# EAGLE design Middle Board - Light (EAGLE 8.6.0)
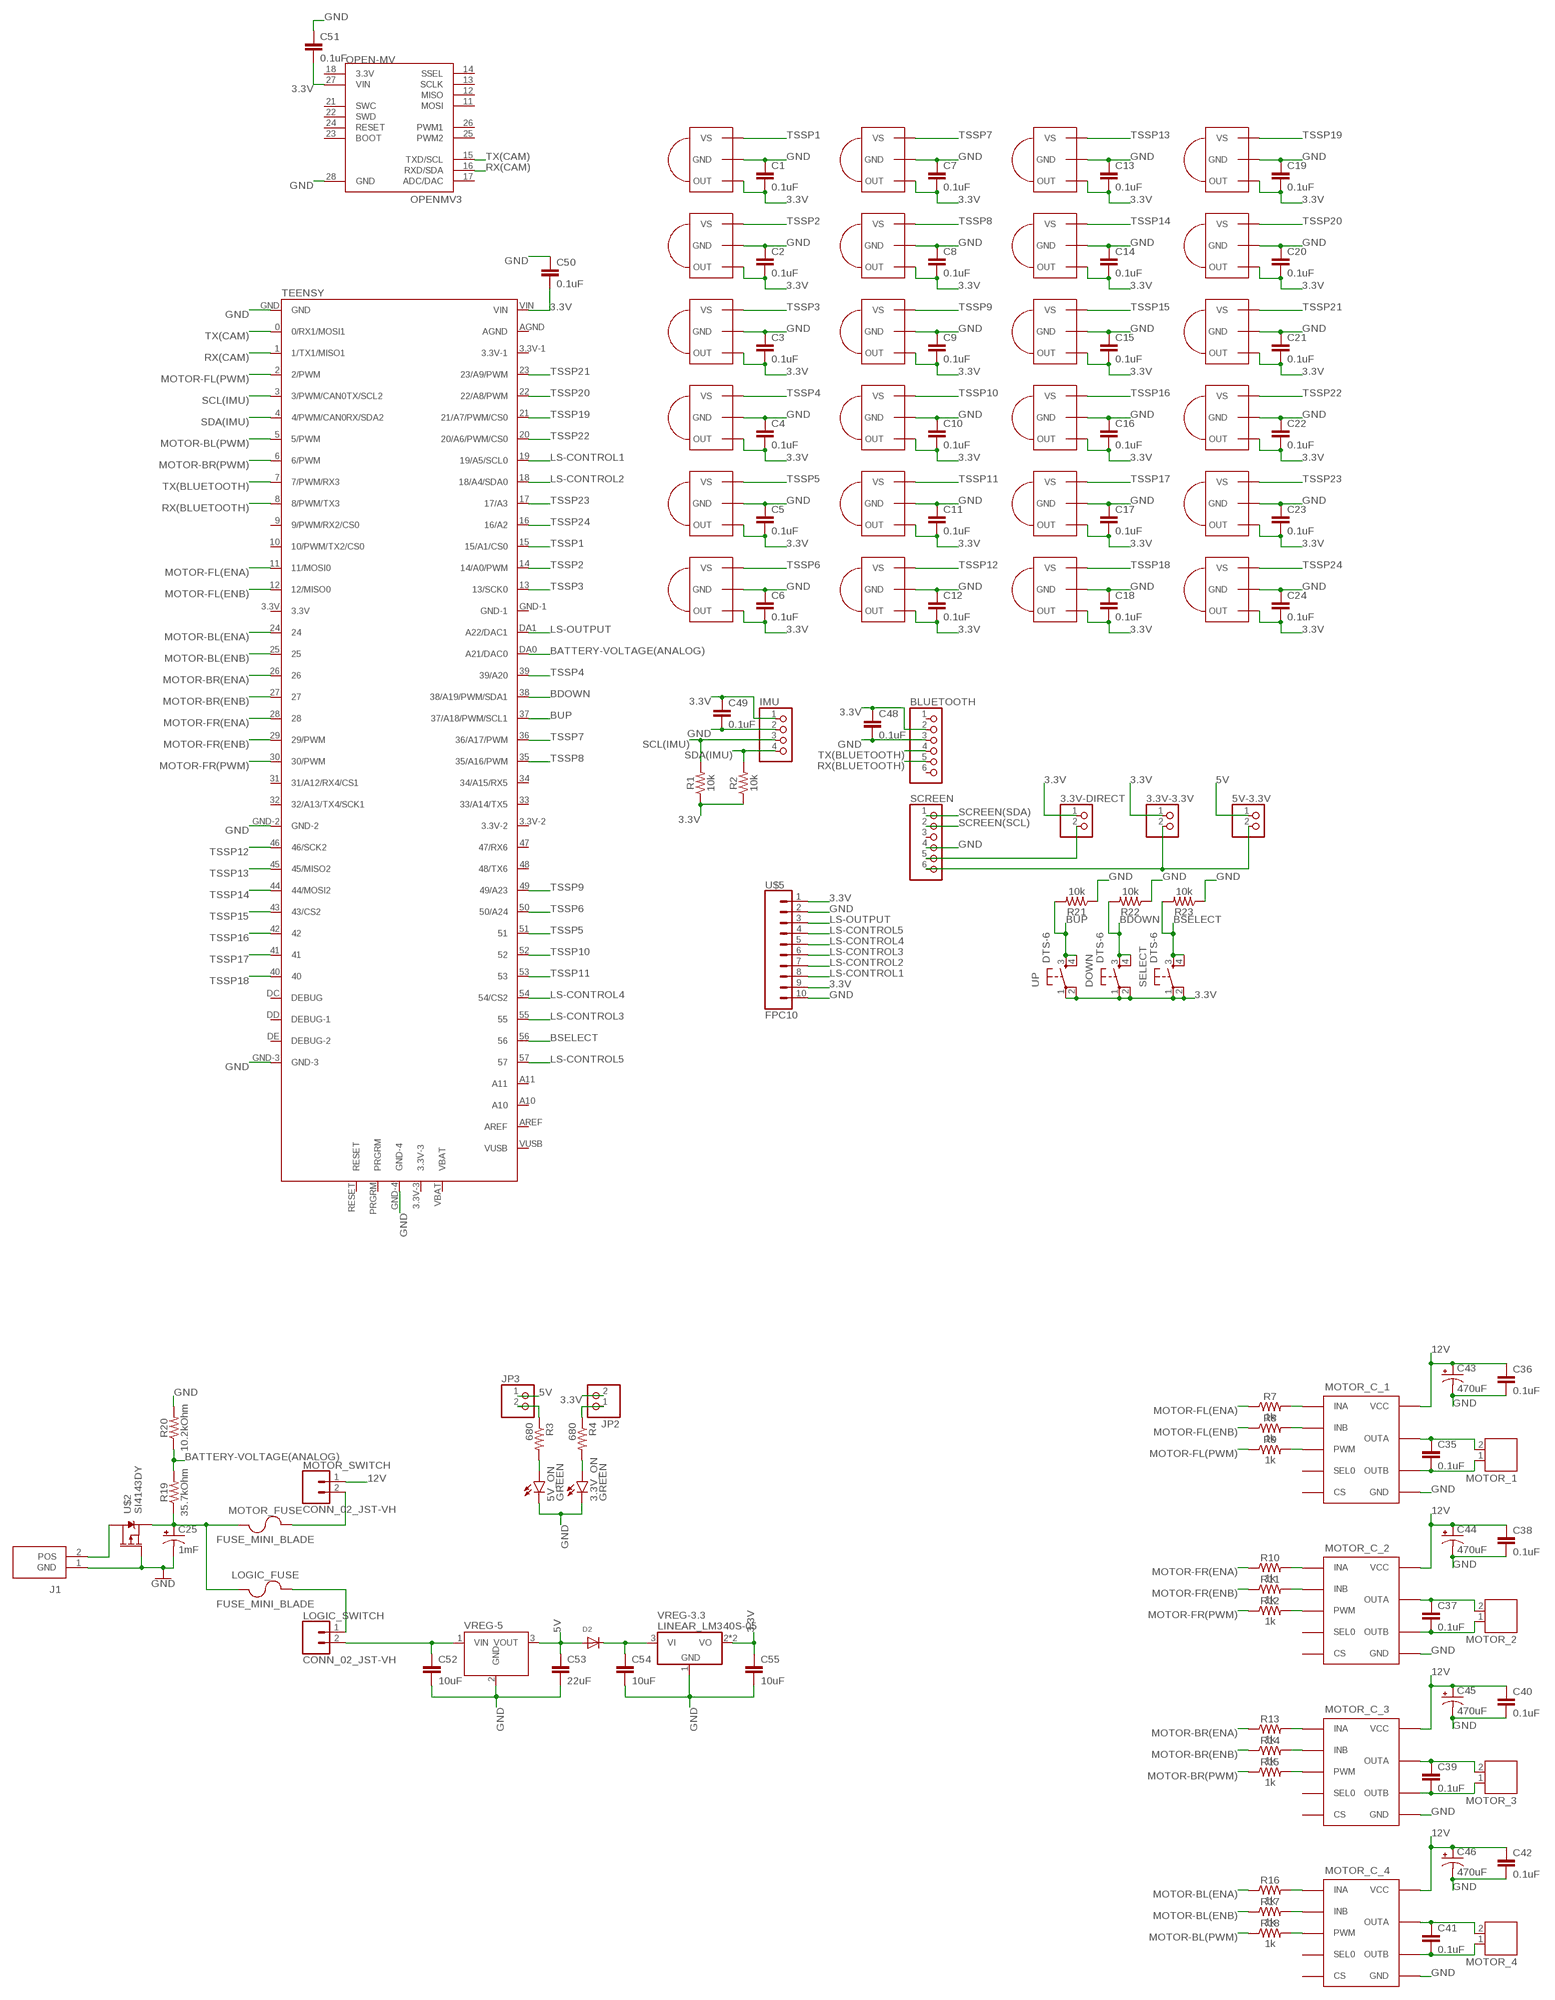
[diagram p0: schematic, sheet 1]

## Parts
3.3V-3.3V  PINHD-1X2  [1X02]
3.3V-DIRECT  PINHD-1X2  [1X02]
3.3V_ON  GREEN  LED_SMD  [LED-0603]
5V-3.3V  PINHD-1X2  [1X02]
5V_ON  GREEN  LED_SMD  [LED-0603]
BLUETOOTH  PINHD-1X6  [1X06]
C1  0.1uF  0.1UF-0603-25V-(+80/-20%)  [0603]
C2  0.1uF  0.1UF-0603-25V-(+80/-20%)  [0603]
C3  0.1uF  0.1UF-0603-25V-(+80/-20%)  [0603]
C4  0.1uF  0.1UF-0603-25V-(+80/-20%)  [0603]
C5  0.1uF  0.1UF-0603-25V-(+80/-20%)  [0603]
C6  0.1uF  0.1UF-0603-25V-(+80/-20%)  [0603]
C7  0.1uF  0.1UF-0603-25V-(+80/-20%)  [0603]
C8  0.1uF  0.1UF-0603-25V-(+80/-20%)  [0603]
C9  0.1uF  0.1UF-0603-25V-(+80/-20%)  [0603]
C10  0.1uF  0.1UF-0603-25V-(+80/-20%)  [0603]
C11  0.1uF  0.1UF-0603-25V-(+80/-20%)  [0603]
C12  0.1uF  0.1UF-0603-25V-(+80/-20%)  [0603]
C13  0.1uF  0.1UF-0603-25V-(+80/-20%)  [0603]
C14  0.1uF  0.1UF-0603-25V-(+80/-20%)  [0603]
C15  0.1uF  0.1UF-0603-25V-(+80/-20%)  [0603]
C16  0.1uF  0.1UF-0603-25V-(+80/-20%)  [0603]
C17  0.1uF  0.1UF-0603-25V-(+80/-20%)  [0603]
C18  0.1uF  0.1UF-0603-25V-(+80/-20%)  [0603]
C19  0.1uF  0.1UF-0603-25V-(+80/-20%)  [0603]
C20  0.1uF  0.1UF-0603-25V-(+80/-20%)  [0603]
C21  0.1uF  0.1UF-0603-25V-(+80/-20%)  [0603]
C22  0.1uF  0.1UF-0603-25V-(+80/-20%)  [0603]
C23  0.1uF  0.1UF-0603-25V-(+80/-20%)  [0603]
C24  0.1uF  0.1UF-0603-25V-(+80/-20%)  [0603]
C25  1mF  1000UF-RADIAL-5MM-25V-20%  [CPOL-RADIAL-5MM-10MM]
C35  0.1uF  0.1UF-0603-25V-(+80/-20%)  [0603]
C36  0.1uF  0.1UF-0603-25V-(+80/-20%)  [0603]
C37  0.1uF  0.1UF-0603-25V-(+80/-20%)  [0603]
C38  0.1uF  0.1UF-0603-25V-(+80/-20%)  [0603]
C39  0.1uF  0.1UF-0603-25V-(+80/-20%)  [0603]
C40  0.1uF  0.1UF-0603-25V-(+80/-20%)  [0603]
C41  0.1uF  0.1UF-0603-25V-(+80/-20%)  [0603]
C42  0.1uF  0.1UF-0603-25V-(+80/-20%)  [0603]
C43  470uF  CPOL-USE3.5-8  [E3,5-8]
C44  470uF  CPOL-USE3.5-8  [E3,5-8]
C45  470uF  CPOL-USE3.5-8  [E3,5-8]
C46  470uF  CPOL-USE3.5-8  [E3,5-8]
C48  0.1uF  0.1UF-0603-25V-(+80/-20%)  [0603]
C49  0.1uF  0.1UF-0603-25V-(+80/-20%)  [0603]
C50  0.1uF  0.1UF-0603-25V-(+80/-20%)  [0603]
C51  0.1uF  0.1UF-0603-25V-(+80/-20%)  [0603]
C52  10uF  0805_CAPACITOR_SMD  [SPARKFUN-CAPACITORS_0805]
C53  22uF  1206_CAPACITOR_SMD  [SPARKFUN-CAPACITORS_1206]
C54  10uF  0805_CAPACITOR_SMD  [SPARKFUN-CAPACITORS_0805]
C55  10uF  0805_CAPACITOR_SMD  [SPARKFUN-CAPACITORS_0805]
D2  ADAFRUIT_DIODE_SOD-123FL:1  [ADAFRUIT_SOD-123FL]
DOWN  DTS-6  [DTS-6]
IMU  PINHD-1X4  [1X04]
J1  PRT-10474  [SHDR2W320P716_1X2_1574X813X158]
JP2  PINHD-1X2/90  [1X02/90]
JP3  PINHD-1X2/90  [1X02/90]
LOGIC_FUSE  FUSE_MINI_BLADE  [SL-1538]
LOGIC_SWITCH  CONN_02_JST-VH  [B2P-VH]
MOTOR_1  JST-PH2  [JST-PH2]
MOTOR_2  JST-PH2  [JST-PH2]
MOTOR_3  JST-PH2  [JST-PH2]
MOTOR_4  JST-PH2  [JST-PH2]
MOTOR_C_1  VNH7100BASTR  [SO-16]
MOTOR_C_2  VNH7100BASTR  [SO-16]
MOTOR_C_3  VNH7100BASTR  [SO-16]
MOTOR_C_4  VNH7100BASTR  [SO-16]
MOTOR_FUSE  FUSE_MINI_BLADE  [SL-1538]
MOTOR_SWITCH  CONN_02_JST-VH  [B2P-VH]
OPEN-MV  OPENMV3  [OPENMV3]
R1  10k  10KOHM-0603-1/10W-1%  [0603]
R2  10k  10KOHM-0603-1/10W-1%  [0603]
R3  680  RESISTOR0603  [0603]
R4  680  RESISTOR0603  [0603]
R7  1k  1KOHM-0603-1/10W-1%  [0603]
R8  1k  1KOHM-0603-1/10W-1%  [0603]
R9  1k  1KOHM-0603-1/10W-1%  [0603]
R10  1k  1KOHM-0603-1/10W-1%  [0603]
R11  1k  1KOHM-0603-1/10W-1%  [0603]
R12  1k  1KOHM-0603-1/10W-1%  [0603]
R13  1k  1KOHM-0603-1/10W-1%  [0603]
R14  1k  1KOHM-0603-1/10W-1%  [0603]
R15  1k  1KOHM-0603-1/10W-1%  [0603]
R16  1k  1KOHM-0603-1/10W-1%  [0603]
R17  1k  1KOHM-0603-1/10W-1%  [0603]
R18  1k  1KOHM-0603-1/10W-1%  [0603]
R19  35.7kOhm  75KOHM-0603-1/10W-1%  [0603]
R20  10.2kOhm  75KOHM-0603-1/10W-1%  [0603]
R21  10k  10KOHM-0603-1/10W-1%  [0603]
R22  10k  10KOHM-0603-1/10W-1%  [0603]
R23  10k  10KOHM-0603-1/10W-1%  [0603]
SCREEN  PINHD-1X6  [1X06]
SELECT  DTS-6  [DTS-6]
TEENSY  TEENSY-3.5  [TEENSY-3.5]
TSSP1  TSSP58038  [MINICAST]
TSSP2  TSSP58038  [MINICAST]
TSSP3  TSSP58038  [MINICAST]
TSSP4  TSSP58038  [MINICAST]
TSSP5  TSSP58038  [MINICAST]
TSSP6  TSSP58038  [MINICAST]
TSSP7  TSSP58038  [MINICAST]
TSSP8  TSSP58038  [MINICAST]
TSSP9  TSSP58038  [MINICAST]
TSSP10  TSSP58038  [MINICAST]
TSSP11  TSSP58038  [MINICAST]
TSSP12  TSSP58038  [MINICAST]
TSSP13  TSSP58038  [MINICAST]
TSSP14  TSSP58038  [MINICAST]
TSSP15  TSSP58038  [MINICAST]
TSSP16  TSSP58038  [MINICAST]
TSSP17  TSSP58038  [MINICAST]
TSSP18  TSSP58038  [MINICAST]
TSSP19  TSSP58038  [MINICAST]
TSSP20  TSSP58038  [MINICAST]
TSSP21  TSSP58038  [MINICAST]
TSSP22  TSSP58038  [MINICAST]
TSSP23  TSSP58038  [MINICAST]
TSSP24  TSSP58038  [MINICAST]
U$2  SI4143DY  [SO-8]
U$5  FPC10  [FPC10]
UP  DTS-6  [DTS-6]
VREG-3.3  LINEAR_LM340S-05  [LINEAR_TO263-3]
VREG-5  V78-2000-SWITCHING-REGULATOR_V78-2000  [V78-2000-SWITCHING-REGULATOR_V78-2000]

## Nets
3.3V: 3.3V-3.3V.1 3.3V-DIRECT.1 BLUETOOTH.2 C1.2 C2.2 C3.2 C4.2 C5.2 C6.2 C7.2 C8.2 C9.2 C10.2 C11.2 C12.2 C13.2 C14.2 C15.2 C16.2 C17.2 C18.2 C19.2 C20.2 C21.2 C22.2 C23.2 C24.2 C48.1 C49.1 C50.2 C51.2 C55.1 DOWN.1 DOWN.2 IMU.1 JP2.2 OPEN-MV.27(VIN) R1.1 R2.1 SELECT.1 SELECT.2 TEENSY.VIN TSSP1.1(OUT) TSSP2.1(OUT) TSSP3.1(OUT) TSSP4.1(OUT) TSSP5.1(OUT) TSSP6.1(OUT) TSSP7.1(OUT) TSSP8.1(OUT) TSSP9.1(OUT) TSSP10.1(OUT) TSSP11.1(OUT) TSSP12.1(OUT) TSSP13.1(OUT) TSSP14.1(OUT) TSSP15.1(OUT) TSSP16.1(OUT) TSSP17.1(OUT) TSSP18.1(OUT) TSSP19.1(OUT) TSSP20.1(OUT) TSSP21.1(OUT) TSSP22.1(OUT) TSSP23.1(OUT) TSSP24.1(OUT) U$5.1 U$5.9 UP.1 UP.2 VREG-3.3.2(VO) VREG-3.3.TAB(VO)
3.3V_ON: JP2.1 R4.1
5V: 5V-3.3V.1 C53.1 D2.A JP3.1 VREG-5.3(VOUT)
5V-ON: JP3.2 R3.1
12V: C36.1 C38.1 C40.1 C42.1 C43.+ C44.+ C45.+ C46.+ MOTOR_C_1.4(VCC) MOTOR_C_1.5(VCC) MOTOR_C_1.12(VCC) MOTOR_C_2.4(VCC) MOTOR_C_2.5(VCC) MOTOR_C_2.12(VCC) MOTOR_C_3.4(VCC) MOTOR_C_3.5(VCC) MOTOR_C_3.12(VCC) MOTOR_C_4.4(VCC) MOTOR_C_4.5(VCC) MOTOR_C_4.12(VCC) MOTOR_SWITCH.1
BATTERY-VOLTAGE(ANALOG): R19.2 R20.1 TEENSY.DA0(A21/DAC0)
BDOWN: DOWN.3 DOWN.4 R22.2 TEENSY.38(38/A19/PWM/SDA1)
BSELECT: R23.2 SELECT.3 SELECT.4 TEENSY.56
BUP: R21.2 TEENSY.37(37/A18/PWM/SCL1) UP.3 UP.4
GND: 3.3V_ON.C 5V_ON.C BLUETOOTH.3 C1.1 C2.1 C3.1 C4.1 C5.1 C6.1 C7.1 C8.1 C9.1 C10.1 C11.1 C12.1 C13.1 C14.1 C15.1 C16.1 C17.1 C18.1 C19.1 C20.1 C21.1 C22.1 C23.1 C24.1 C25.- C36.2 C38.2 C40.2 C42.2 C43.- C44.- C45.- C46.- C48.2 C49.2 C50.1 C51.1 C52.2 C53.2 C54.2 C55.2 IMU.2 J1.1(GND) MOTOR_C_1.1(GND) MOTOR_C_1.8(GND) MOTOR_C_1.9(GND) MOTOR_C_1.16(GND) MOTOR_C_2.1(GND) MOTOR_C_2.8(GND) MOTOR_C_2.9(GND) MOTOR_C_2.16(GND) MOTOR_C_3.1(GND) MOTOR_C_3.8(GND) MOTOR_C_3.9(GND) MOTOR_C_3.16(GND) MOTOR_C_4.1(GND) MOTOR_C_4.8(GND) MOTOR_C_4.9(GND) MOTOR_C_4.16(GND) OPEN-MV.28(GND) R20.2 R21.1 R22.1 R23.1 SCREEN.4 TEENSY.GND TEENSY.GND-2 TEENSY.GND-3 TEENSY.GND-4 TSSP1.2(GND) TSSP2.2(GND) TSSP3.2(GND) TSSP4.2(GND) TSSP5.2(GND) TSSP6.2(GND) TSSP7.2(GND) TSSP8.2(GND) TSSP9.2(GND) TSSP10.2(GND) TSSP11.2(GND) TSSP12.2(GND) TSSP13.2(GND) TSSP14.2(GND) TSSP15.2(GND) TSSP16.2(GND) TSSP17.2(GND) TSSP18.2(GND) TSSP19.2(GND) TSSP20.2(GND) TSSP21.2(GND) TSSP22.2(GND) TSSP23.2(GND) TSSP24.2(GND) U$2.4(G) U$5.2 U$5.10 VREG-3.3.1(GND) VREG-5.2(GND)
LS-CONTROL1: TEENSY.19(19/A5/SCL0) U$5.8
LS-CONTROL2: TEENSY.18(18/A4/SDA0) U$5.7
LS-CONTROL3: TEENSY.55 U$5.6
LS-CONTROL4: TEENSY.54(54/CS2) U$5.5
LS-CONTROL5: TEENSY.57 U$5.4
LS-OUTPUT: TEENSY.DA1(A22/DAC1) U$5.3
MOTOR-BL(ENA): R16.1 TEENSY.24
MOTOR-BL(ENB): R17.1 TEENSY.25
MOTOR-BL(PWM): R18.1 TEENSY.5(5/PWM)
MOTOR-BR(ENA): R13.1 TEENSY.26
MOTOR-BR(ENB): R14.1 TEENSY.27
MOTOR-BR(PWM): R15.1 TEENSY.6(6/PWM)
MOTOR-FL(ENA): R7.1 TEENSY.11(11/MOSI0)
MOTOR-FL(ENB): R8.1 TEENSY.12(12/MISO0)
MOTOR-FL(PWM): R9.1 TEENSY.2(2/PWM)
MOTOR-FR(ENA): R10.1 TEENSY.28
MOTOR-FR(ENB): R11.1 TEENSY.29(29/PWM)
MOTOR-FR(PWM): R12.1 TEENSY.30(30/PWM)
N$1: J1.2(POS) U$2.5(D) U$2.6(D) U$2.7(D) U$2.8(D)
N$2: MOTOR_FUSE.P$2 MOTOR_SWITCH.2
N$3: C25.+ LOGIC_FUSE.P$1 MOTOR_FUSE.P$1 R19.1 U$2.1(S) U$2.2(S) U$2.3(S)
N$4: LOGIC_FUSE.P$2 LOGIC_SWITCH.1
N$5: MOTOR_C_1.3(INA) R7.2
N$6: 5V_ON.A R3.2
N$7: 3.3V_ON.A R4.2
N$12: MOTOR_C_1.6(INB) R8.2
N$15: MOTOR_C_1.11(PWM) R9.2
N$16: C35.1 MOTOR_1.2 MOTOR_C_1.2(OUTA) MOTOR_C_1.15(OUTA)
N$17: C35.2 MOTOR_1.1 MOTOR_C_1.7(OUTB) MOTOR_C_1.10(OUTB)
N$18: MOTOR_C_2.3(INA) R10.2
N$19: MOTOR_C_2.6(INB) R11.2
N$20: MOTOR_C_2.11(PWM) R12.2
N$21: C37.1 MOTOR_2.2 MOTOR_C_2.2(OUTA) MOTOR_C_2.15(OUTA)
N$22: C37.2 MOTOR_2.1 MOTOR_C_2.7(OUTB) MOTOR_C_2.10(OUTB)
N$23: MOTOR_C_3.3(INA) R13.2
N$24: MOTOR_C_3.6(INB) R14.2
N$25: MOTOR_C_3.11(PWM) R15.2
N$26: C39.1 MOTOR_3.2 MOTOR_C_3.2(OUTA) MOTOR_C_3.15(OUTA)
N$27: C39.2 MOTOR_3.1 MOTOR_C_3.7(OUTB) MOTOR_C_3.10(OUTB)
N$28: MOTOR_C_4.3(INA) R16.2
N$29: MOTOR_C_4.6(INB) R17.2
N$30: MOTOR_C_4.11(PWM) R18.2
N$31: C41.1 MOTOR_4.2 MOTOR_C_4.2(OUTA) MOTOR_C_4.15(OUTA)
N$32: C41.2 MOTOR_4.1 MOTOR_C_4.7(OUTB) MOTOR_C_4.10(OUTB)
N$35: 3.3V-DIRECT.2 SCREEN.5
N$37: 3.3V-3.3V.2 5V-3.3V.2 SCREEN.6
N$40: C52.1 LOGIC_SWITCH.2 VREG-5.1(VIN)
N$41: C54.1 D2.C VREG-3.3.3(VI)
RX(BLUETOOTH): BLUETOOTH.5 TEENSY.8(8/PWM/TX3)
RX(CAM): OPEN-MV.16(RXD/SDA) TEENSY.1(1/TX1/MISO1)
SCL(IMU): IMU.3 R1.2 TEENSY.3(3/PWM/CAN0TX/SCL2)
SCREEN(SCL): SCREEN.2
SCREEN(SDA): SCREEN.1
SDA(IMU): IMU.4 R2.2 TEENSY.4(4/PWM/CAN0RX/SDA2)
TSSP1: TEENSY.15(15/A1/CS0) TSSP1.3(VS)
TSSP2: TEENSY.14(14/A0/PWM) TSSP2.3(VS)
TSSP3: TEENSY.13(13/SCK0) TSSP3.3(VS)
TSSP4: TEENSY.39(39/A20) TSSP4.3(VS)
TSSP5: TEENSY.51 TSSP5.3(VS)
TSSP6: TEENSY.50(50/A24) TSSP6.3(VS)
TSSP7: TEENSY.36(36/A17/PWM) TSSP7.3(VS)
TSSP8: TEENSY.35(35/A16/PWM) TSSP8.3(VS)
TSSP9: TEENSY.49(49/A23) TSSP9.3(VS)
TSSP10: TEENSY.52 TSSP10.3(VS)
TSSP11: TEENSY.53 TSSP11.3(VS)
TSSP12: TEENSY.46(46/SCK2) TSSP12.3(VS)
TSSP13: TEENSY.45(45/MISO2) TSSP13.3(VS)
TSSP14: TEENSY.44(44/MOSI2) TSSP14.3(VS)
TSSP15: TEENSY.43(43/CS2) TSSP15.3(VS)
TSSP16: TEENSY.42 TSSP16.3(VS)
TSSP17: TEENSY.41 TSSP17.3(VS)
TSSP18: TEENSY.40 TSSP18.3(VS)
TSSP19: TEENSY.21(21/A7/PWM/CS0) TSSP19.3(VS)
TSSP20: TEENSY.22(22/A8/PWM) TSSP20.3(VS)
TSSP21: TEENSY.23(23/A9/PWM) TSSP21.3(VS)
TSSP22: TEENSY.20(20/A6/PWM/CS0) TSSP22.3(VS)
TSSP23: TEENSY.17(17/A3) TSSP23.3(VS)
TSSP24: TEENSY.16(16/A2) TSSP24.3(VS)
TX(BLUETOOTH): BLUETOOTH.4 TEENSY.7(7/PWM/RX3)
TX(CAM): OPEN-MV.15(TXD/SCL) TEENSY.0(0/RX1/MOSI1)
Unconnected: BLUETOOTH.1 BLUETOOTH.6 MOTOR_C_1.13(CS) MOTOR_C_1.14(SEL0) MOTOR_C_2.13(CS) MOTOR_C_2.14(SEL0) MOTOR_C_3.13(CS) MOTOR_C_3.14(SEL0) MOTOR_C_4.13(CS) MOTOR_C_4.14(SEL0) OPEN-MV.11(MOSI) OPEN-MV.12(MISO) OPEN-MV.13(SCLK) OPEN-MV.14(SSEL) OPEN-MV.17(ADC/DAC) OPEN-MV.18(3.3V) OPEN-MV.21(SWC) OPEN-MV.22(SWD) OPEN-MV.23(BOOT) OPEN-MV.24(RESET) OPEN-MV.25(PWM2) OPEN-MV.26(PWM1) SCREEN.3 TEENSY.3.3V TEENSY.3.3V-1 TEENSY.3.3V-2 TEENSY.3.3V-3 TEENSY.9(9/PWM/RX2/CS0) TEENSY.10(10/PWM/TX2/CS0) TEENSY.31(31/A12/RX4/CS1) TEENSY.32(32/A13/TX4/SCK1) TEENSY.33(33/A14/TX5) TEENSY.34(34/A15/RX5) TEENSY.47(47/RX6) TEENSY.48(48/TX6) TEENSY.A10 TEENSY.A11 TEENSY.AGND TEENSY.AREF TEENSY.DC(DEBUG) TEENSY.DD(DEBUG-1) TEENSY.DE(DEBUG-2) TEENSY.GND-1 TEENSY.PRGRM TEENSY.RESET TEENSY.VBAT TEENSY.VUSB

## Library data of the parts
3.3V-3.3V 3.3V-DIRECT 5V-3.3V JP2 JP3 = PinHead+:PINHD-1X2: PIN HEADER
3.3V_ON 5V_ON = SparkFun-LED:LED_SMD
BLUETOOTH SCREEN = PinHead+:PINHD-1X6: PIN HEADER
C1-C24 C35-C42 C48-C51 = SparkFun-Capacitors:0.1UF: 0.1µF ceramic capacitors A capacitor is a passive two-terminal electrical component used to store electrical energy temporarily in an electric field.; PROD_ID: CAP-00810
C25 = SparkFun-Capacitors:1000UF: 1,000µF/1mF ceramic capacitors A capacitor is a passive two-terminal electrical component used to store electrical energy temporarily in an electric field. CAP-08070; PROD_ID: CAP-09538
C43-C46 = adafruit:CPOL-US: POLARIZED CAPACITOR, American symbol
C52 C54 C55 = Capacitors:0805_CAPACITOR_SMD
C53 = Capacitors:1206_CAPACITOR_SMD
D2 = Main:ADAFRUIT_DIODE*?:1: Diode SMADIODE - SMA Surface Mount Package 20V 1A Schottky Diode Digikey: 641-1014-6-ND DO-1N4148 - Through Hole Small Current Diode SOD-123 20V 1 A (.5mV Vf) Schottky Diode - Digikey: MBRX120TPMSCT-ND SOD-323 10V 570mA (.38mV Vf, 3ns) Schottky Diode - Digikey: ZLLS410CT-ND SOD-523 30V 30mA Schottky Diode (RB751S-40TE61) - Digikey: RB751S-40TE61CT-ND SOT23-R/W - SOT23 Package (R = Solder Paste/Reflow Ovens, W = Hand-Soldering) BAT54Film 40V 300mA - Digikey: 497-7162-1-ND
DOWN SELECT UP = switch-tact:DTS-6
IMU = PinHead+:PINHD-1X4: PIN HEADER
J1 = XT60:PRT-10474: Soldering Workstation Equipment XT60 Connectors Male/Female Pair Source: Datasheet <http://cdn.sparkfun.com/datasheets/Prototyping/xt60.pdf>; ARROW_PART_NUMBER: PRT-10474; DESCRIPTION: Soldering Workstation Equipment XT60 Connectors Male/Female Pair; HEIGHT: 15.875mm; MANUFACTURER_NAME: SparkFun; MANUFACTURER_PART_NUMBER: PRT-10474
LOGIC_FUSE MOTOR_FUSE = Fuse_Holder:FUSE_MINI_BLADE: SL-1538 Aliexpress <https://www.aliexpress.com/item/SL-1538-MINI-Style-Blade-Fuse-Holers-PCB-Mount-Fuse-holders-0153008/503553051.html>
LOGIC_SWITCH MOTOR_SWITCH = JST-VH:CONN_02_JST-VH: B2P-VH(LF)(SN) Digikey <https://www.digikey.com.au/product-detail/en/jst-sales-america-inc/B2P-VH-LF-SN/455-1639-ND/926547>
MOTOR_1-MOTOR_4 = jst-ph:JST-PH2
MOTOR_C_1-MOTOR_C_4 = VNH7100BASTR:VNH7100BASTR: VNH7100BASTR
OPEN-MV = OpenMV:OPENMV3
R1 R2 R21-R23 = SparkFun-Resistors:10KOHM: 10kΩ resistor A resistor is a passive two-terminal electrical component that implements electrical resistance as a circuit element. Resistors act to reduce current flow, and, at the same time, act to lower voltage levels within circuits. - Wikipedia; PROD_ID: RES-00824
R3 R4 = SparkFun-Resistors:RESISTOR: Generic Resistor Package
R7-R18 = SparkFun-Resistors:1KOHM: 1kΩ resistor A resistor is a passive two-terminal electrical component that implements electrical resistance as a circuit element. Resistors act to reduce current flow, and, at the same time, act to lower voltage levels within circuits. - Wikipedia; PROD_ID: RES-07856
R19 R20 = SparkFun-Resistors:75KOHM: 75Ω resistor A resistor is a passive two-terminal electrical component that implements electrical resistance as a circuit element. Resistors act to reduce current flow, and, at the same time, act to lower voltage levels within circuits. - Wikipedia; PROD_ID: RES-09737; VALUE: 75
TEENSY = teensy-3.5:TEENSY-3.5
TSSP1-TSSP24 = IR Receivers:TSSP58038: IR Receiver Module for Light Barrier Systems datasheet <http://www.vishay.com/docs/82479/tssp58038.pdf>
U$2 = MOSFET:SI4143DY: MOSFET P-CHANNEL 30V 25.3A 8SO Digikey <https://www.digikey.com.au/product-detail/en/vishay-siliconix/SI4143DY-T1-GE3/SI4143DY-T1-GE3CT-ND/6834487>
U$5 = FFC:FPC10
VREG-3.3 = Main:LINEAR_LM340?-*: Positive VOLTAGE REGULATOR Source: http://cache.national.com/ds/LM/LM340.pdf
VREG-5 = Main:V78-2000-SWITCHING-REGULATOR_V78-2000

## Board
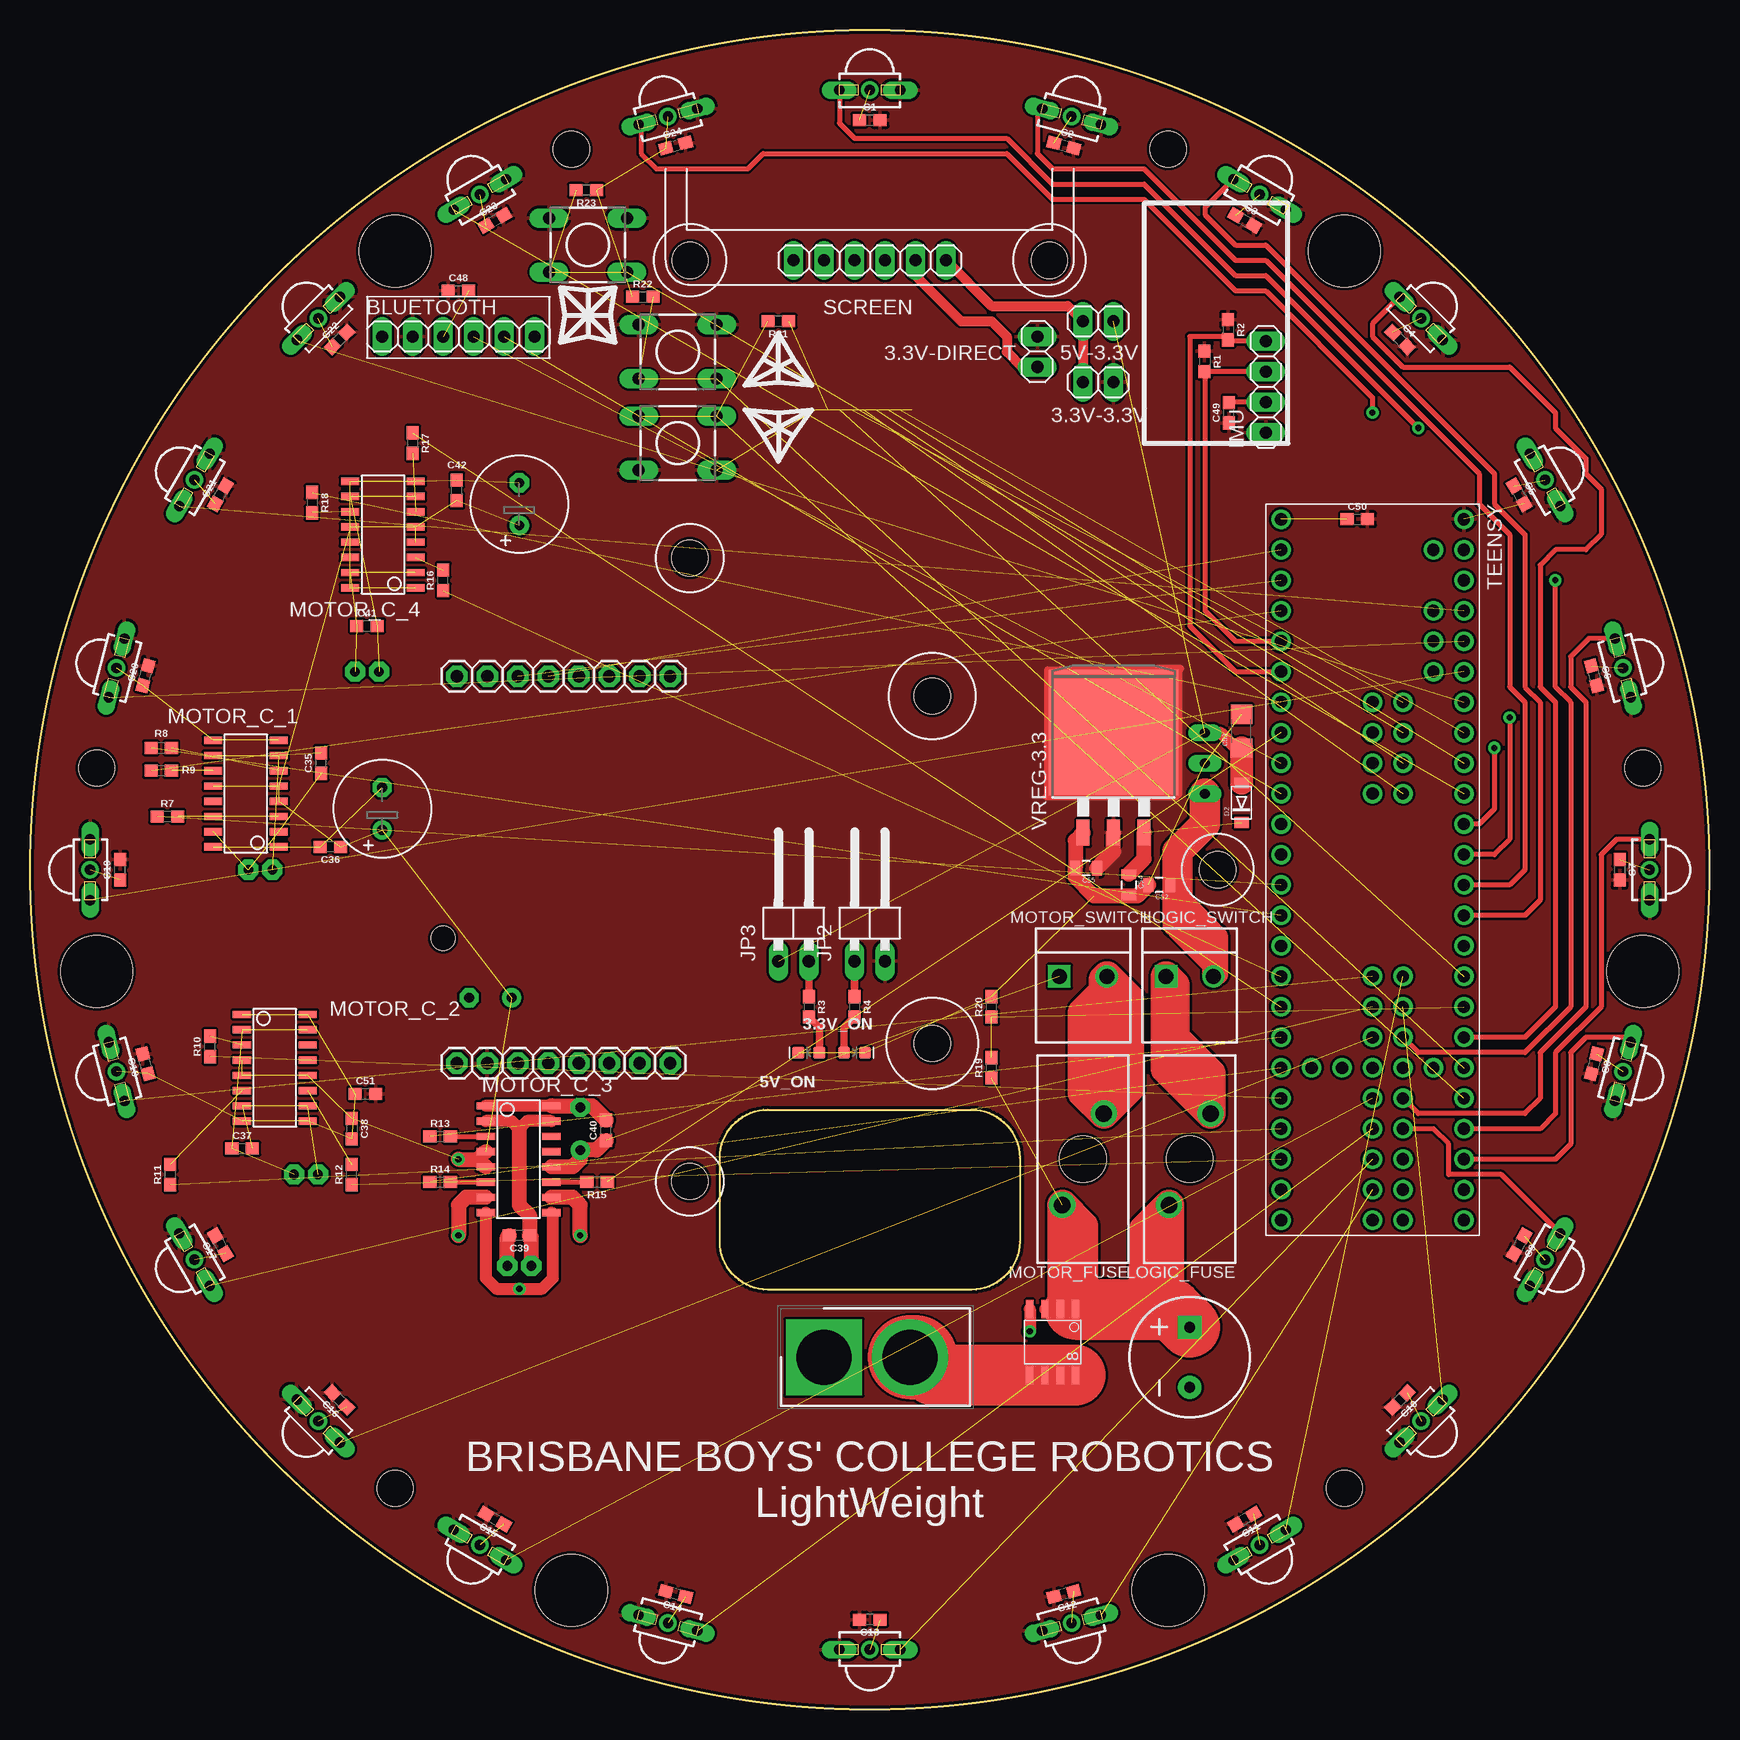
[diagram p1: board, top side]
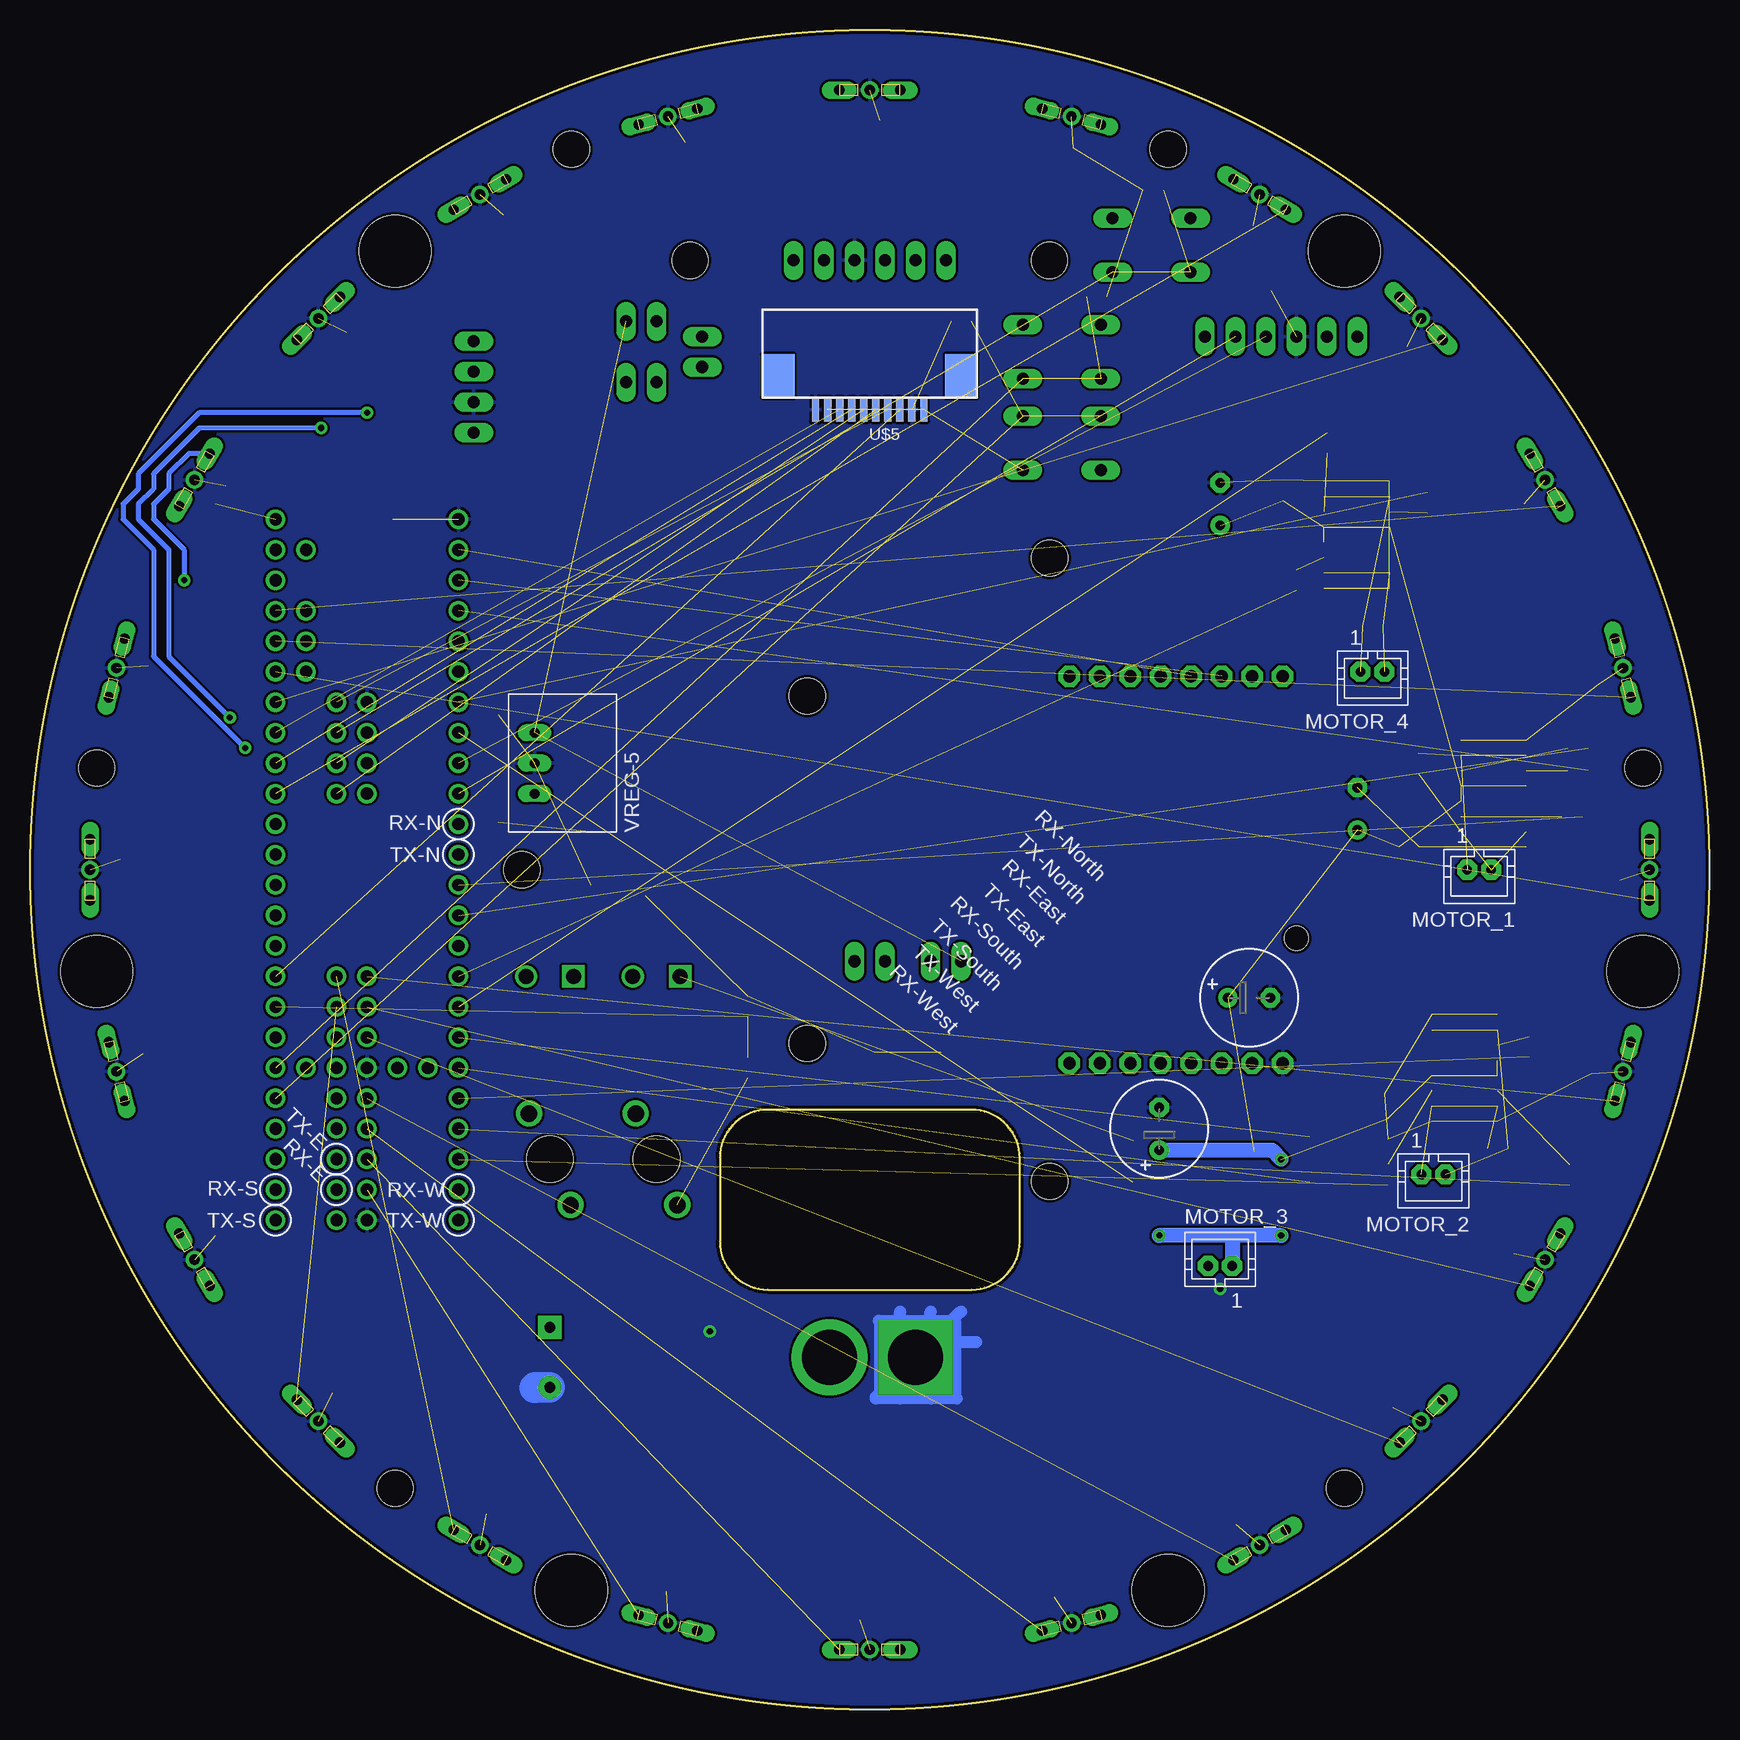
[diagram p2: board, bottom side, seen from below]

Size 140 x 140 mm. Coordinates in mm from the lower left corner, seen from the top.
Outline: 61.5,50 78.5,50 arc-90 82.5,46 82.5,39 arc-90 78.5,35 61.5,35 arc-90 57.5,39 57.5,46 arc-90 61.5,50
Outline: circle at 70,70 radius 70
Copper layers (1*16): Top 0.035mm / dielectric 1.5mm / Bottom 0.035mm
Design rules "SparkFun": minimum track width 8mil, minimum drill 20mil, track to track 8mil, track to pad 8mil, pad to pad 8mil, via to via 8mil, smd to smd 8mil, copper to edge 10mil, drill to drill 8mil, minimum pad ring 12mil, minimum via ring 10mil, stop-mask expansion 4mil, vias tented up to drill 25mil, thermal gap 10mil
Holes 3 mm at 75.21,84.48 75.21,55.52 94.87,130.05 45.13,130.05 5.56,78.48 30.43,18.43 109.57,18.43 134.44,78.48 55,95.98 99,70 55,44.02 84.99,120.8 55.01,120.8
Holes 6 mm at 30.43,121.57 45.13,9.95 94.87,9.95 109.57,121.57 134.44,61.52 5.56,61.52
Holes 2 mm at 34.44,64.28

### Footprints (pad centres in the part's own frame; a part is rotated, then mirrored left to right if it is on the bottom)
1X02 = drill 1.016 long: 1 -1.27,0; 2 1.27,0
LED-0603 = smd 1 x 1: A -0.877,0; C 0.877,0
1X06 = drill 1.016 long: 1 -6.35,0; 2 -3.81,0; 3 -1.27,0; 4 1.27,0; 5 3.81,0; 6 6.35,0
0603 = smd 1.1 x 1: 1 -0.85,0; 2 0.85,0
CPOL-RADIAL-5MM-10MM = drill 0.9 pad 1.93 square: + 2.5,0 | drill 0.9 pad 1.93: - -2.5,0
E3,5-8 = drill 0.813 pad 1.6: + -1.778,0 | drill 0.813 pad 1.6 octagon: - 1.778,0
SPARKFUN-CAPACITORS_0805 = smd 0.8 x 1.2: 1 -0.9,0; 2 0.9,0
SPARKFUN-CAPACITORS_1206 = smd 1.6 x 1.8: 1 -1.4,0; 2 1.4,0
ADAFRUIT_SOD-123FL = smd 0.91 x 1.22: A 1.637,0; C -1.637,0
DTS-6 = drill 1 long: 1 -3.25,2.25; 2 3.25,2.25; 3 -3.25,-2.25; 4 3.25,-2.25
1X04 = drill 1.016 long: 1 -3.81,0; 2 -1.27,0; 3 1.27,0; 4 3.81,0
SHDR2W320P716_1X2_1574X813X158 = drill 4.572 pad 6.35 square: 1 0,0 | drill 4.572 pad 6.35: 2 7.163,0
1X02/90 = drill 1.016 long: 1 -1.27,-3.81; 2 1.27,-3.81
SL-1538 = drill 1.37 pad 2.184: P$1 1.73,3.81; P$2 -1.73,-3.81 | hole 3.88: 0,0
B2P-VH = drill 1.25 square: 1 -1.98,0 | drill 1.24: 2 1.98,0
JST-PH2 = drill 0.813 pad 1.676 octagon: 1 1,0; 2 -1,0
SO-16 = smd 0.61 x 1.524: 1 -4.445,-2.794; 2 -3.175,-2.794; 3 -1.905,-2.794; 4 -0.635,-2.794; 5 0.635,-2.794; 6 1.905,-2.794; 7 3.175,-2.794; 8 4.445,-2.794; 9 4.445,2.667; 10 3.175,2.667; 11 1.905,2.667; 12 0.635,2.667; 13 -0.635,2.667; 14 -1.905,2.667; 15 -3.175,2.667; 16 -4.445,2.667
OPENMV3 = drill 1.016 pad 1.778 octagon: 11 1.651,19.304; 12 1.651,16.764; 13 1.651,14.224; 14 1.651,11.684; 15 1.651,9.144; 16 1.651,6.604; 17 1.651,4.064; 18 1.651,1.524; 21 33.909,19.304; 22 33.909,16.764; 23 33.909,14.224; 24 33.909,11.684; 25 33.909,9.144; 26 33.909,6.604; 27 33.909,4.064; 28 33.909,1.524
TEENSY-3.5 = drill 1.016: 0 -7.62,26.67; 1 -7.62,24.13; 2 -7.62,21.59; 3 -7.62,19.05; 3.3V -7.62,-6.35; 3.3V-1 7.62,24.13; 3.3V-2 2.54,-29.21; 3.3V-3 -2.54,-16.51; 4 -7.62,16.51; 5 -7.62,13.97; 6 -7.62,11.43; 7 -7.62,8.89; 8 -7.62,6.35; 9 -7.62,3.81; 10 -7.62,1.27; 11 -7.62,-1.27; 12 -7.62,-3.81; 13 7.62,-3.81; 14 7.62,-1.27; 15 7.62,1.27; 16 7.62,3.81; 17 7.62,6.35; 18 7.62,8.89; 19 7.62,11.43; 20 7.62,13.97; 21 7.62,16.51; 22 7.62,19.05; 23 7.62,21.59; 24 -7.62,-8.89; 25 -7.62,-11.43; 26 -7.62,-13.97; 27 -7.62,-16.51; 28 -7.62,-19.05; 29 -7.62,-21.59; 30 -7.62,-24.13; 31 -7.62,-26.67; 32 -7.62,-29.21; 33 7.62,-29.21; 34 7.62,-26.67; 35 7.62,-24.13; 36 7.62,-21.59; 37 7.62,-19.05; 38 7.62,-16.51; 39 7.62,-13.97; 40 0,-8.89; 41 0,-11.43; 42 0,-13.97; 43 0,-19.05; 44 0,-21.59; 45 0,-24.13; 46 0,-26.67; 47 2.54,-26.67; 48 2.54,-24.13; 49 2.54,-21.59; 50 2.54,-19.05; 51 2.54,-13.97; 52 2.54,-11.43; 53 2.54,-8.89; 54 2.54,6.35; 55 2.54,8.89; 56 2.54,11.43; 57 2.54,13.97; A10 5.08,19.05; A11 5.08,16.51; AGND 7.62,26.67; AREF 5.08,21.59; DA0 7.62,-11.43; DA1 7.62,-8.89; DC 0,8.89; DD 0,6.35; DE 0,11.43; GND -7.62,29.21; GND-1 7.62,-6.35; GND-2 0,-29.21; GND-3 0,-16.51; GND-4 0,13.97; PRGRM 2.54,-16.51; RESET 5.08,-16.51; VBAT -5.08,-16.51; VIN 7.62,29.21; VUSB 5.08,26.67
MINICAST = drill 0.85 long: 1 0,2.54; 3 0,-2.54 | drill 0.85: 2 0,0
SO-8 = smd 1.524 x 0.61: 1 -2.743,1.905; 2 -2.743,0.635; 3 -2.743,-0.635; 4 -2.743,-1.905; 5 2.743,-1.905; 6 2.743,-0.635; 7 2.743,0.635; 8 2.743,1.905
FPC10 = smd 0.61 x 2.007: 1 -4.515,1.003; 2 -3.512,1.003; 3 -2.508,1.003; 4 -1.505,1.003; 5 -0.502,1.003; 6 0.502,1.003; 7 1.505,1.003; 8 2.508,1.003; 9 3.512,1.003; 10 4.515,1.003 | smd 2.667 x 3.607: N/C-1 -7.62,-1.803; N/C-2 7.62,-1.803
LINEAR_TO263-3 = smd 1.067 x 2.159: 1 -2.54,-5.791; 2 0,-5.791; 3 2.54,-5.791 | smd 10.8 x 10.41: TAB 0,2.54
V78-2000-SWITCHING-REGULATOR_V78-2000 = drill 0.8 long: 1 -2.54,0; 2 0,0; 3 2.54,0

### Placement (x,y rotation side)
3.3V-3.3V  89.05,110.64 180 top
3.3V-DIRECT  83.97,113.18 270 top
3.3V_ON  68.73,54.76 0 top
5V-3.3V  89.05,115.72 180 top
5V_ON  64.92,54.76 180 top
BLUETOOTH  35.71,114.45 0 top
C1  70,132.5 0 top
C2  86.18,130.37 345 top
C3  101.25,124.13 330 top
C4  114.19,114.19 315 top
C5  124.13,101.25 300 top
C6  130.37,86.18 285 top
C7  132.5,70 270 top
C8  130.37,53.82 255 top
C9  124.13,38.75 240 top
C10  114.19,25.81 225 top
C11  101.25,15.87 210 top
C12  86.18,9.63 195 top
C13  70,7.5 180 top
C14  53.82,9.63 165 top
C15  38.75,15.87 150 top
C16  25.81,25.81 135 top
C17  15.87,38.75 120 top
C18  9.63,53.82 105 top
C19  7.5,70 90 top
C20  9.63,86.18 75 top
C21  15.87,101.25 60 top
C22  25.81,114.19 45 top
C23  38.75,124.13 30 top
C24  53.82,130.37 15 top
C25  96.67,29.36 90 top
C35  24.28,78.89 90 top
C36  25.04,71.91 180 top
C37  17.68,46.76 0 top
C38  26.82,48.41 270 top
C39  40.79,39.52 180 top
C40  48.03,48.28 90 top
C41  28.09,90.32 0 top
C42  35.58,101.62 90 top
C43  29.36,75.08 90 top
C44  38.38,59.33 0 bottom
C45  45.87,48.41 90 bottom
C46  40.79,100.48 90 top
C48  35.71,118.26 0 top
C49  99.95,108.1 90 top
C50  110.64,99.21 0 top
C51  27.96,51.33 0 top
C52  94.13,68.73 180 top
C53  100.99,81.56 90 top
C54  91.59,68.73 270 top
C55  88.03,70.13 180 top
D2  100.99,75.59 90 top
DOWN  54,113.18 0 top
IMU  103.02,110.26 90 top
J1  66.19,29.36 0 top
JP2  70,66.19 0 top
JP3  63.65,66.19 0 top
LOGIC_FUSE  96.67,45.87 180 top
LOGIC_SWITCH  96.67,61.11 0 top
MOTOR_1  19.2,70 180 bottom
MOTOR_2  23.01,44.6 180 bottom
MOTOR_3  40.79,36.98 0 bottom
MOTOR_4  28.09,86.51 180 bottom
MOTOR_C_1  17.93,76.35 90 top
MOTOR_C_2  20.47,53.49 270 top
MOTOR_C_3  40.79,45.87 270 top
MOTOR_C_4  29.36,97.94 90 top
MOTOR_FUSE  87.78,45.87 180 top
MOTOR_SWITCH  87.78,61.11 0 top
OPEN-MV  34.06,87.78 270 top
R1  97.9,112.38 270 top
R2  99.87,115.01 270 top
R3  64.92,58.57 270 top
R4  68.73,58.57 270 top
R7  11.45,74.44 0 top
R8  10.95,80.16 0 top
R9  10.95,78.25 0 top
R10  15.01,55.27 90 top
R11  11.71,44.6 90 top
R12  26.82,44.6 90 top
R13  34.19,47.77 0 top
R14  34.19,43.97 0 top
R15  47.27,43.97 180 top
R16  34.44,94.13 90 top
R17  31.9,105.56 270 top
R18  23.52,100.61 270 top
R19  80.16,53.49 90 top
R20  80.16,58.57 90 top
R21  62.38,115.72 180 top
R22  51.08,117.75 0 top
R23  46.38,126.64 180 top
SCREEN  70,120.8 0 top
SELECT  46.5,122.07 0 top
TEENSY  111.91,70 0 top
TSSP1  70,135 270 top
TSSP2  86.82,132.79 255 top
TSSP3  102.5,126.29 240 top
TSSP4  115.96,115.96 225 top
TSSP5  126.29,102.5 210 top
TSSP6  132.79,86.82 195 top
TSSP7  135,70 180 top
TSSP8  132.79,53.18 165 top
TSSP9  126.29,37.5 150 top
TSSP10  115.96,24.04 135 top
TSSP11  102.5,13.71 120 top
TSSP12  86.82,7.21 105 top
TSSP13  70,5 90 top
TSSP14  53.18,7.21 75 top
TSSP15  37.5,13.71 60 top
TSSP16  24.04,24.04 45 top
TSSP17  13.71,37.5 30 top
TSSP18  7.21,53.18 15 top
TSSP19  5,70 0 top
TSSP20  7.21,86.82 345 top
TSSP21  13.71,102.5 330 top
TSSP22  24.04,115.96 315 top
TSSP23  37.5,126.29 300 top
TSSP24  53.18,132.79 285 top
U$2  85.24,30.63 270 top
U$5  70,109.37 180 bottom
UP  54,105.56 180 top
VREG-3.3  90.32,78.89 0 top
VREG-5  97.94,78.89 90 bottom

### Tracks (layer width: path | path; a pad name or v marks a point on that pad's centre or on a via)
3.3V  (3 unrouted)
  Top 0.61: VREG-3.3.TAB 90.32,86.51 90.19,86.64 84.86,86.64 84.86,76.22 84.73,76.1 95.53,76.1 95.78,76.35 95.78,86.64 95.91,86.76 90.83,86.76 90.7,86.64
  Top 1.27: C55.1 90.32,71.51 VREG-3.3.2
  pour Top: 68.73,152.55 39.52,152.55 -10.01,103.02 -10.01,29.36 29.36,-10.01 133.5,-10.01 137.31,-13.82 171.6,20.47 171.6,73.81 171.6,109.37 152.55,128.42 128.42,152.55
3.3V_ON
  Top 0.61: R4.1 JP2.1
5V  (2 unrouted)
  Top 1.016: VREG-5.3 99.21,81.43 100.48,80.16 C53.1
  Top 1.905: C53.1 D2.A
5V-ON
  Top 0.61: R3.1 JP3.2
12V  (via drill 0.51)  (16 unrouted)
  Top 1.27: MOTOR_C_3.12 45.23,45.23 45.87,45.87 C45.+ 47.23,46.63 C40.1 | 37.36,45.87 MOTOR_C_3.4 | v35.71,45.87 37.36,45.87 | 37.36,45.87 MOTOR_C_3.5
  Bottom 1.27: C45.+ 36.47,46.63 v35.71,45.87
BATTERY-VOLTAGE(ANALOG)  (2 unrouted)
BDOWN  (3 unrouted)
BSELECT  (3 unrouted)
BUP  (3 unrouted)
GND  (via drill 0.51)  (50 unrouted)
  Top 0.406: IMU.2 99.99,108.99 C49.2
  Top 1.016: MOTOR_C_3.16 MOTOR_C_3.1 | MOTOR_C_3.8 38,35.96 38.89,35.08 v40.79,35.08 42.7,35.08 43.58,35.96 43.58,41.3 MOTOR_C_3.9 | U$2.4 v83.34,31.52
  Top 1.27: MOTOR_C_3.16 45.74,50.31 | 45.74,50.31 C45.- | C40.2 46.85,50.31 45.74,50.31 | C52.2 92.33,67.83 C54.2 88.68,67.83 87.13,69.38 C55.2 87.13,72.45 VREG-3.3.1
  Bottom 1.016: 69.49,25.93 69.11,26.31 69.11,28.09 | 69.11,32.28 69.24,32.41 63.02,32.41 62.89,32.28 62.89,28.09 | 62.89,28.09 62.89,26.31 | J1.1 62.76,25.93 64.92,25.93 | 64.92,25.93 67.46,25.93 | 67.46,25.93 69.49,25.93 | 69.11,28.09 69.11,30.63 | 69.11,30.63 69.11,32.28 | J1.1 62.38,33.17 | J1.1 69.11,32.28 | J1.1 69.49,26.06 69.49,25.93 | 67.46,28.09 67.46,25.93 | J1.1 67.46,28.09 | 67.46,28.09 69.11,28.09 | 64.92,28.09 62.89,28.09 | J1.1 64.92,28.09 | 64.92,28.09 64.92,25.93 | 64.92,30.63 61.11,30.63 | J1.1 64.92,30.63 | 64.92,30.63 64.92,33.17 | 67.46,30.63 67.46,33.17 | J1.1 67.46,30.63 | 67.46,30.63 69.11,30.63
  Bottom 2.54: C25.- 97.9,26.86 97.94,26.82
  pour Bottom: 66.19,142.39 23.01,142.39 -2.39,116.99 -3.66,115.72 -3.66,28.09 28.09,-3.66 35.71,-3.66 116.99,-3.66 130.96,10.31 147.47,26.82 147.47,80.16 147.47,111.91 128.42,130.96 116.99,142.39
LS-CONTROL1  (1 unrouted)
LS-CONTROL2  (1 unrouted)
LS-CONTROL3  (1 unrouted)
LS-CONTROL4  (1 unrouted)
LS-CONTROL5  (1 unrouted)
LS-OUTPUT  (1 unrouted)
MOTOR-BL(ENA)  (1 unrouted)
MOTOR-BL(ENB)  (1 unrouted)
MOTOR-BL(PWM)  (1 unrouted)
MOTOR-BR(ENA)  (1 unrouted)
MOTOR-BR(ENB)  (1 unrouted)
MOTOR-BR(PWM)  (1 unrouted)
MOTOR-FL(ENA)  (1 unrouted)
MOTOR-FL(ENB)  (1 unrouted)
MOTOR-FL(PWM)  (1 unrouted)
MOTOR-FR(ENA)  (1 unrouted)
MOTOR-FR(ENB)  (1 unrouted)
MOTOR-FR(PWM)  (1 unrouted)
N$1
  Top 5.08: 73.81,29.36 75.28,27.89 U$2.5 U$2.6 U$2.7 U$2.8
  Top 6.985: J1.2 73.81,29.36
N$2
  Top 2.54: MOTOR_FUSE.P$2 89.51,59.84 | 89.51,59.84 89.51,60.86 MOTOR_SWITCH.2 91.59,59.28 91.59,51.76 MOTOR_FUSE.P$2 | MOTOR_FUSE.P$2 87.78,51.41 87.78,58.11 89.51,59.84
N$3  (1 unrouted)
  Top 1.016: U$2.3 U$2.2
  Top 2.54: U$2.1 U$2.2 86.05,33.55 MOTOR_FUSE.P$1 87.78,40.33 87.78,34.44 | 95.16,33.37 94.94,33.59 LOGIC_FUSE.P$1 92.86,39.98 92.86,35.71
  Top 5.08: U$2.1 95.16,33.37 C25.+
N$4
  Top 2.54: LOGIC_SWITCH.1 94.69,53.39 LOGIC_FUSE.P$2 98.4,53.03 95.4,56.03 95.4,60.4 LOGIC_SWITCH.1
N$5  (1 unrouted)
N$6
  Top 0.61: 5V_ON.A 65.8,56.84 R3.2
N$7
  Top 0.61: 3.3V_ON.A 67.85,56.84 R4.2
N$12  (1 unrouted)
N$15  (1 unrouted)
N$16  (3 unrouted)
N$17  (3 unrouted)
N$18  (1 unrouted)
N$19  (1 unrouted)
N$20  (1 unrouted)
N$21  (3 unrouted)
N$22  (3 unrouted)
N$23
  Top 0.406: R13.2 MOTOR_C_3.3
N$24
  Top 0.406: R14.2 MOTOR_C_3.6
N$25
  Top 0.406: MOTOR_C_3.11 R15.2
N$26
  Top 1.016: MOTOR_C_3.15 41.42,49.05 40.79,48.41 40.16,49.05 MOTOR_C_3.2
  Top 1.27: 40.79,48.41 40.79,42.06 41.64,41.21 C39.1 41.79,39.37 MOTOR_3.2
N$27  (via drill 0.51)
  Top 1.27: MOTOR_3.1 39.79,39.37 C39.2 | MOTOR_C_3.7 36.34,42.7 35.71,42.06 v35.71,39.52 | MOTOR_C_3.10 45.23,42.7 45.87,42.06 v45.87,39.52
  Bottom 1.27: v35.71,39.52 39.52,39.52 | 39.52,39.52 v45.87,39.52 | 39.52,39.52 39.79,39.25 MOTOR_3.1
N$28  (1 unrouted)
N$29  (1 unrouted)
N$30  (1 unrouted)
N$31  (3 unrouted)
N$32  (3 unrouted)
N$35
  Top 0.813: SCREEN.5 73.81,119.53 77.62,115.72 80.16,115.72 81.43,114.45 81.43,113.18 82.7,111.91 3.3V-DIRECT.2
N$37
  Top 0.813: SCREEN.6 80.16,116.99 86.51,116.99 5V-3.3V.2 3.3V-3.3V.2
N$40
  Top 1.27: C52.1 95.03,65.29 95.4,64.92 | 95.4,64.92 98.65,61.67 99.21,61.11 99.21,64.55 98.65,65.11 | 96.67,67.09 98.65,65.11 | 98.65,65.11 98.65,62.94 | C52.1 96.67,67.09 | 96.67,67.09 96.67,64.92 | C52.1 95.4,68.36 95.4,64.92
  Top 1.905: LOGIC_SWITCH.2 98.65,61.67 98.65,62.94 96.67,64.92
  Top 2.54: VREG-5.1 97.94,73.81 95.65,71.52 95.65,65.94 96.67,64.92
N$41  (1 unrouted)
  Top 1.27: C54.1 92.86,70.9 VREG-3.3.3
RX(BLUETOOTH)  (1 unrouted)
RX(CAM)  (1 unrouted)
SCL(IMU)
  Top 0.406: IMU.3 R1.2 97.94,111.49 97.94,91.59 100.48,89.05 TEENSY.3
SDA(IMU)
  Top 0.406: IMU.4 99.96,114.07 R2.2 99.58,114.45 96.67,114.45 96.67,90.32 100.48,86.51 TEENSY.4
TSSP1  (via drill 0.51)
  Top 0.406: TSSP1.3 67.46,132.23 68.73,130.96 81.43,130.96 85.24,127.15 92.86,127.15 100.48,119.53 103.02,119.53 v115.72,106.83 | v123.34,82.7 123.34,72.54 122.07,71.27 TEENSY.15
  Bottom 0.406: v115.72,106.83 125.88,106.83 129.69,103.02 129.69,101.75 130.96,100.48 130.96,99.21 128.42,96.67 128.42,87.78 v123.34,82.7
TSSP2
  Top 0.406: TSSP2.3 83.97,133.04 83.97,129.69 85.24,128.42 92.86,128.42 100.48,120.8 103.02,120.8 120.8,103.02 120.8,100.48 123.34,97.94 123.34,85.24 124.61,83.97 124.61,70 123.34,68.73 TEENSY.14
TSSP3
  Top 0.406: TSSP3.3 97.94,125.2 97.94,124.61 100.48,122.07 103.02,122.07 122.07,103.02 122.07,100.48 124.61,97.94 124.61,85.24 125.88,83.97 125.88,67.46 124.61,66.19 TEENSY.13
TSSP4
  Top 0.406: TSSP4.3 111.91,115.5 111.91,114.45 114.45,111.91 123.34,111.91 127.15,108.1 127.15,106.83 129.69,104.29 129.69,103.02 130.96,101.75 130.96,97.94 129.69,96.67 127.15,96.67 125.88,95.4 125.88,85.24 127.15,83.97 127.15,58.57 124.61,56.03 TEENSY.39
TSSP5  (via drill 0.51)
  Top 0.406: TEENSY.51 115.72,54.76 124.61,54.76 128.42,58.57 128.42,83.97 127.15,85.24 v127.15,94.13
  Bottom 0.406: TSSP5.3 126.74,104.7 128.42,103.02 128.42,101.75 129.69,100.48 129.69,99.21 127.15,96.67 v127.15,94.13
TSSP6
  Top 0.406: TSSP6.3 129.92,89.28 128.42,87.78 128.42,85.24 129.69,83.97 129.69,58.57 125.88,54.76 125.88,50.95 124.61,49.68 115.72,49.68 TEENSY.50
TSSP7
  Top 0.406: TSSP7.3 132.23,72.54 130.96,71.27 130.96,58.57 127.15,54.76 127.15,49.68 125.88,48.41 TEENSY.36
TSSP8
  Top 0.406: TSSP8.3 133.04,56.03 129.69,56.03 128.42,54.76 128.42,47.14 127.15,45.87 TEENSY.35
TSSP9
  Top 0.406: TSSP9.3 122.66,44.6 118.26,44.6 118.26,47.14 116.99,48.41 TEENSY.49
TSSP10  (1 unrouted)
TSSP11  (1 unrouted)
TSSP12  (1 unrouted)
TSSP13  (1 unrouted)
TSSP14  (1 unrouted)
TSSP15  (1 unrouted)
TSSP16  (1 unrouted)
TSSP17  (1 unrouted)
TSSP18  (1 unrouted)
TSSP19  (1 unrouted)
TSSP20  (1 unrouted)
TSSP21  (1 unrouted)
TSSP22  (1 unrouted)
TSSP23  (1 unrouted)
TSSP24  (via drill 0.51)
  Top 0.406: TSSP24.3 50.95,131.9 50.95,129.69 52.22,128.42 59.84,128.42 61.11,129.69 81.43,129.69 85.24,125.88 92.86,125.88 100.48,118.26 103.02,118.26 111.91,109.37 v111.91,108.1 | v122.07,80.16 122.07,75.08 120.8,73.81 TEENSY.16
  Bottom 0.406: v111.91,108.1 125.88,108.1 130.96,103.02 130.96,101.75 132.23,100.48 132.23,99.21 129.69,96.67 129.69,87.78 v122.07,80.16
TX(BLUETOOTH)  (1 unrouted)
TX(CAM)  (1 unrouted)

### Text on the board
tPlace: BRISBANE BOYS' COLLEGE ROBOTICS / LightWeight
bPlace: RX-N | TX-N | RX-North | TX-North | RX-East | TX-East | RX-South | TX-South | TX-West | RX-West | TX-E | RX-E | RX-W | RX-S | TX-W | TX-S